# EAGLE design ConnectorBoard (EAGLE 9.1.3)
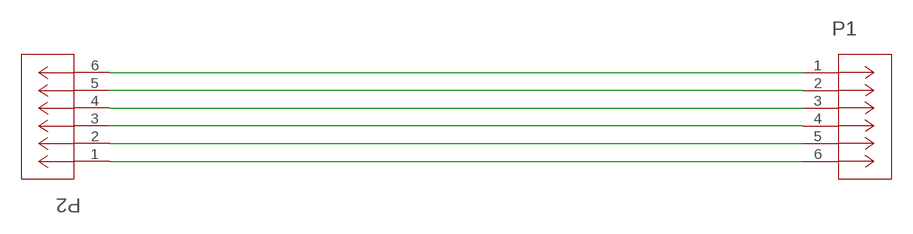
[diagram p0: schematic, sheet 1]

## Parts
P1  6PINJSTS6B-ZR(LF)(SN)  [S6B-ZR]
P2  6PINJSTS6B-ZR(LF)(SN)  [S6B-ZR]

## Nets
N$1: P1.6 P2.1
N$2: P1.5 P2.2
N$3: P1.4 P2.3
N$4: P1.3 P2.4
N$5: P1.2 P2.5
N$6: P1.1 P2.6

## Library data of the parts
P1 P2 = DROP 6pin JST:6PINJSTS6B-ZR(LF)(SN): 6 pin JST Connector Sourced from Digikey; MANUFACTURER_PART_NUMBER: S6BZRLFSN; VENDOR: JST

## Board
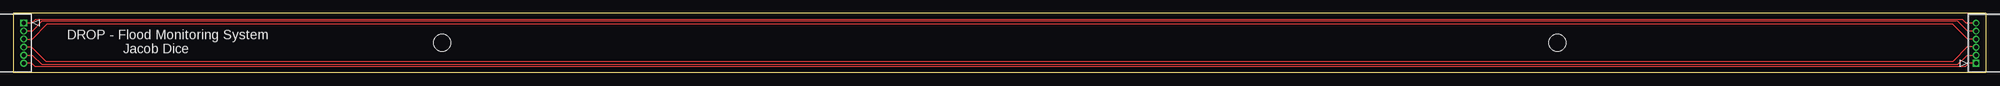
[diagram p1: board, top side]

Size 368 x 11 mm. Coordinates in mm from the lower left corner, seen from the top.
Outline: 0,0 368,0 368,11 0,11 0,0
Copper layers (1*16): Top 0.035mm / dielectric 1.5mm / Bottom 0.035mm
Design rules "default": minimum track width 6mil, minimum drill 0.35mm, track to track 6mil, track to pad 6mil, pad to pad 6mil, via to via 6mil, smd to smd 6mil, copper to edge 40mil, drill to drill 6mil, minimum pad ring 10mil, minimum via ring 8mil, stop-mask expansion 4mil, vias tented up to drill 0mil, thermal gap 10mil
Holes 3.2 mm at 80,5.5 288,5.5

### Footprints (pad centres in the part's own frame; a part is rotated, then mirrored left to right if it is on the bottom)
S6B-ZR = drill 0.762 pad 1.27 square: 1 -7.493,0 | drill 0.762 pad 1.27: 2 -5.994,0; 3 -4.496,0; 4 -2.997,0; 5 -1.499,0; 6 0,0

### Placement (x,y rotation side)
P1  1.91,1.72 270 top
P2  366.13,9.2 90 top

### Tracks (layer width: path | path; a pad name or v marks a point on that pad's centre or on a via)
N$1
  Top 0.152: P2.1 364.71,1.71 364.09,1.09 4.04,1.09 3.41,1.72 P1.6
N$2
  Top 0.152: P1.5 3.53,3.22 5.25,1.5 362.75,1.5 364.46,3.21 P2.2
N$3
  Top 0.152: P1.4 3.41,4.72 6.13,2 361.75,2 364.5,4.75 366.08,4.75 P2.3
N$4
  Top 0.152: P1.3 3.47,6.22 6.25,9 361.75,9 364.55,6.21 P2.4
N$5
  Top 0.152: P2.5 364.55,7.7 362.75,9.5 5.25,9.5 3.47,7.72 P1.2
N$6
  Top 0.152: P1.1 3.47,9.22 4.16,9.91 363.59,9.91 364.25,9.25 366.08,9.25 P2.6

### Text on the board
tNames: DROP - Flood Monitoring System / Jacob Dice